# Altium schematic sheet senzMate_ecandMoisture_design_cycle2.SchDoc
size A
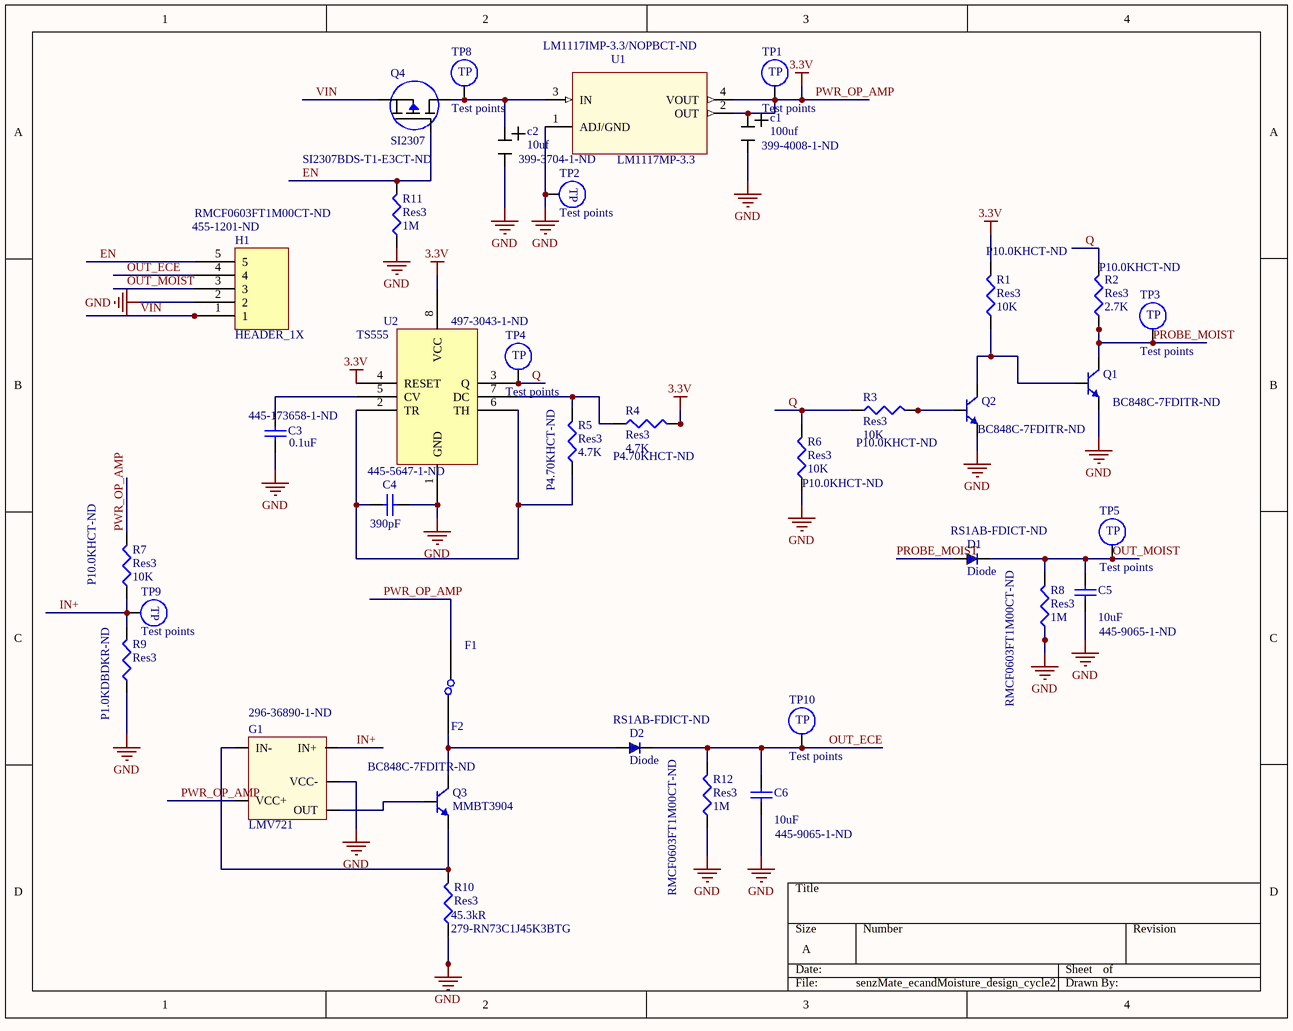
[diagram p0: senzMate_ecandMoisture_design_cycle2.SchDoc]

## Parts
c1  100uf  Supplier Part Number 1: 399-4008-1-ND  [tan_cap]
c2  10uf  Supplier Part Number 1: 399-3704-1-ND  [tan_cap]
C3  value 0.1uF  Supplier Part Number 1: 445-173658-1-ND  [CAPACITOR_0603]  (hidden comment: SMT Ceremic capacitors)
C4  value 390pF  Supplier Part Number 1: 445-5647-1-ND  [CAPACITOR_0603]  (hidden comment: SMT Ceremic capacitors)
C5  value 10uF  Supplier Part Number 1: 445-9065-1-ND  [CAPACITOR_0603]  (hidden comment: SMT Ceremic capacitors)
C6  value 10uF  Supplier Part Number 1: 445-9065-1-ND  [CAPACITOR_0603]  (hidden comment: SMT Ceremic capacitors)
D1  Diode  Supplier Part Number 1: RS1AB-FDICT-ND  [Diode]
D2  Diode  Supplier Part Number 1: RS1AB-FDICT-ND  [Diode]
F1  Hole  [HOLE]  (value not drawn)
F2  Hole  [HOLE]  (value not drawn)
G1  LMV721  Supplier Part Number 1: 296-36890-1-ND  [lm721]
H1  HEADER_1X  Supplier Part Number 1: 455-1201-ND  [CONNECTOR]
Q1  Supplier Part Number 1: BC848C-7FDITR-ND  [SOT95P245X110-3N]
Q2  Supplier Part Number 1: BC848C-7FDITR-ND  [SOT95P245X110-3N]
Q3  MMBT3904  Supplier Part Number 1: BC848C-7FDITR-ND  [SOT95P245X110-3N]
Q4  SI2307  Supplier Part Number 1: SI2307BDS-T1-E3CT-ND  [SI2307]
R1  Res3  value 10K  Supplier Part Number 1: P10.0KHCT-ND  [RES_0603]
R2  Res3  value 2.7K  Supplier Part Number 1: P10.0KHCT-ND  [RES_0603]
R3  Res3  value 10K  Supplier Part Number 1: P10.0KHCT-ND  [RES_0603]
R4  Res3  value 4.7K  Supplier Part Number 1: P4.70KHCT-ND  [RES_0603]
R5  Res3  value 4.7K  Supplier Part Number 1: P4.70KHCT-ND  [RES_0603]
R6  Res3  value 10K  Supplier Part Number 1: P10.0KHCT-ND  [RES_0603]
R7  Res3  value 10K  Supplier Part Number 1: P10.0KHCT-ND  [RES_0603]
R8  Res3  value 1M  Supplier Part Number 1: RMCF0603FT1M00CT-ND  [RES_0603]
R9  Res3  Supplier Part Number 1: P1.0KDBDKR-ND  [RES_0603]
R10  Res3  Supplier Part Number 1: 279-RN73C1J45K3BTG  Resistance: 45.3kR  [RES_0603]
R11  Res3  value 1M  Supplier Part Number 1: RMCF0603FT1M00CT-ND  [RES_0603]
R12  Res3  value 1M  Supplier Part Number 1: RMCF0603FT1M00CT-ND  [RES_0603]
TP1  Test points  [Test_point]
TP2  Test points  [Test_point]
TP3  Test points  [Test_point]
TP4  Test points  [Test_point]
TP5  Test points  [Test_point]
TP8  Test points  [Test_point]
TP9  Test points  [Test_point]
TP10  Test points  [Test_point]
U1  LM1117MP-3.3  Supplier Part Number 1: LM1117IMP-3.3/NOPBCT-ND  [*SOT230P696X180-4N]
U2  TS555  Supplier Part Number 1: 497-3043-1-ND  [SOP127P600X175-8N]

## Nets
GND: c1.2 c2.2 C3.1 C4.1 C5.1 C6.1 G1.2(VCC-) H1.2 Q1.1(E) Q2.1(E) R6.1 R8.1 R9.1 R10.1 R11.1 R12.1 TP2.1 U1.1(ADJ/GND) U2.1(GND)
PWR_OP_AMP: c1.1 F1.1 G1.5(VCC+) R1.2 R4.2 R7.2 TP1.1 U1.2(OUT) U1.4(VOUT) U2.4(RESET) U2.8(VCC)  [also labelled 3.3V]
EN: H1.5 Q4.1(Gate) R11.2
IN+: G1.3(IN+) R7.1 R9.2 TP9.1
OUT_ECE: C6.2 D2.2(K) H1.4 R12.2 TP10.1
OUT_MOIST: C5.2 D1.2(K) H1.3 R8.2 TP5.1
PROBE_MOIST: D1.1(A) Q1.3(C) R2.1 TP3.1
Q: R2.2 R3.1 R6.2 TP4.1 U2.3(Q)
VIN: H1.1 Q4.2(Source)
Netc2_1: c2.1 Q4.3(Drain) TP8.1 U1.3(IN)
NetC3_2: C3.2 U2.5(CV)
NetC4_2: C4.2 R5.1 U2.2(TR) U2.6(TH)
NetD2_1: D2.1(A) F2.1 Q3.3(C)
NetG1_1: G1.1(OUT) Q3.2(B)
NetG1_4: G1.4(IN-) Q3.1(E) R10.2
NetQ1_2: Q1.2(B) Q2.3(C) R1.1
NetQ2_2: Q2.2(B) R3.2
NetR4_1: R4.1 R5.2 U2.7(DC)

## Library data of the parts
c1 = tant_cap: Tantalum Surface Mount Capacitors – Standard Tantalum; Manufacturer: KEMET; Manufacturer Part Number: T520B107M006ATE040; Voltage Rating: 6.3V; Tolerance: 20%; ESR (Equivalent Series Resistance): 40mR; Voltage Rating (DC): 6V; Polarity: Polar; Dissipation Factor: 8%; Leakage Current: 63uA; Ripple Current: 3A; Life (Hours): 2000Hour; Supplier 1: Digi-Key; Stock 1: 86697; Pricing 1: 1=0.88, 10=0.665, 100=0.4759, 500=0.3685, 1000=0.3173 (USD); Mount: Surface Mount,PCB; Case/Package: 1411; Number of Pins: 2; Case Code (Imperial): 1411; Case Code (Metric): 3528; Dielectric Material: Tantalum; Min Operating Temperature: -55°C; Max Operating Temperature: 105°C; Capacitance: 100uF; Packaging: Tape and Reel; Package Quantity: 1; Termination: SMD/SMT; Features: General Purpose; Voltage: 6.3V; Length: 3.5mm; Height: 1.9mm; Width: 2.8mm; Height - Seated (Max): 0.083inch; Depth: 2.8mm; Lead Pitch: 1.9mm; Radiation Hardening: No; Lead Free: Lead Free; REACH SVHC: No SVHC; ComponentLink1URL: http://www.mouser.com/ds/2/212/KEM_T2015_T520-368569.pdf?src-supplier=Mouser; ComponentLink1Description: http://www.mouser.com/ds/2/212/KEM_T2015_T520-368569.pdf?src-supplier=Mouser; ComponentLink2URL: https://www.verical.com/server-webapp/html/getDatasheet?partID=72546&src-supplier=Verical; ComponentLink2Description: https://www.verical.com/server-webapp/html/getDatasheet?partID=72546&src-supplier=Verical; ComponentLink3URL: https://www.distrelec.biz/Web/Downloads/_t/ds/KEM_T2015_T520_eng_tds.pdf?mime=application%2Fpdf&src-supplier=Distrelec; ComponentLink3Description: https://www.distrelec.biz/Web/Downloads/_t/ds/KEM_T2015_T520_eng_tds.pdf?mime=application%2Fpdf&src-supplier=Distrelec; ComponentLink4URL: https://www.alliedelec.com/m/d/1e5f3e263f50a84b9c01f3b24923ff5b.pdf?src-supplier=Allied+Electronics; ComponentLink4Description: https://www.alliedelec.com/m/d/1e5f3e263f50a84b9c01f3b24923ff5b.pdf?src-supplier=Allied+Electronics; ComponentLink5URL: http://www.farnell.com/datasheets/40865.pdf?src-supplier=Farnell; ComponentLink5Description: http://www.farnell.com/datasheets/40865.pdf?src-supplier=Farnell; ComponentLink6URL: https://content.kemet.com/datasheets/KEM_T2076_T52X-530.pdf?src-supplier=Digi-Key; ComponentLink6Description: https://content.kemet.com/datasheets/KEM_T2076_T52X-530.pdf?src-supplier=Digi-Key; ComponentLink7URL: http://www.kemet.com/kemet/web/homepage/kechome.nsf/file/T520%20Series/$file/KEM_T2015_T520.pdf?src-supplier=Element14; ComponentLink7Description: http://www.kemet.com/kemet/web/homepage/kechome.nsf/file/T520%20Series/$file/KEM_T2015_T520.pdf?src-supplier=Element14; Value: 100uF
c2 = tant_cap: Tantalum Surface Mount Capacitors – Standard Tantalum; Manufacturer: KEMET; Manufacturer Part Number: T491B106K006AT; Voltage Rating (DC): 6.3V; ESR (Equivalent Series Resistance): 3.5R; Tolerance: 10%; Polarity: Polar; Dissipation Factor: 6%; Leakage Current: 600nA; Ripple Current: 156mA; Life (Hours): 2000Hour; Supplier 1: Digi-Key; Stock 1: 12761; Pricing 1: 1=0.49, 10=0.345, 100=0.227, 500=0.1681, 1000=0.1429 (USD); Mount: Surface Mount,PCB; Case/Package: 1411; Number of Pins: 2; Weight: 0.002293oz; Case Code (Imperial): 1411; Case Code (Metric): 3528; Dielectric Material: Tantalum; Min Operating Temperature: -55°C; Max Operating Temperature: 125°C; Package Quantity: 1; Capacitance: 10uF; Voltage Rating: 6.3V; Packaging: Tape and Reel; Termination: SMD/SMT; Features: General Purpose; Voltage: 6.3V; Length: 3.5mm; Height: 1.9mm; Width: 2.8mm; Height - Seated (Max): 0.083inch; Depth: 2.8mm; Radiation Hardening: No; REACH SVHC: No SVHC; Lead Free: Lead Free; ComponentLink1URL: http://www.mouser.com/ds/2/212/KEM_T2005_T491-1093550.pdf?src-supplier=Mouser; ComponentLink1Description: http://www.mouser.com/ds/2/212/KEM_T2005_T491-1093550.pdf?src-supplier=Mouser; ComponentLink2URL: https://www.verical.com/server-webapp/html/getDatasheet?partID=114876&src-supplier=Verical; ComponentLink2Description: https://www.verical.com/server-webapp/html/getDatasheet?partID=114876&src-supplier=Verical; ComponentLink3URL: https://search.kemet.com/component-edge/download/datasheet/T491B106K006AT.pdf?src-supplier=Digi-Key; ComponentLink3Description: https://search.kemet.com/component-edge/download/datasheet/T491B106K006AT.pdf?src-supplier=Digi-Key; ComponentLink4URL: https://www.alliedelec.com/m/d/1172a60f7bb3eb66344f86e8fb9ddbde.pdf?src-supplier=Allied+Electronics; ComponentLink4Description: https://www.alliedelec.com/m/d/1172a60f7bb3eb66344f86e8fb9ddbde.pdf?src-supplier=Allied+Electronics; ComponentLink5URL: http://www.kemet.com/kemet/web/homepage/kechome.nsf/file/T491%20Series/$file/KEM_T2005_T491.pdf?src-supplier=Farnell; ComponentLink5Description: http://www.kemet.com/kemet/web/homepage/kechome.nsf/file/T491%20Series/$file/KEM_T2005_T491.pdf?src-supplier=Farnell; ComponentLink6URL: http://www.farnell.com/datasheets/1854511.pdf?src-supplier=Element14; ComponentLink6Description: http://www.farnell.com/datasheets/1854511.pdf?src-supplier=Element14; ComponentLink7URL: http://www.kemet.com/kemet/web/homepage/kechome.nsf/file/T491%20Series/$file/KEM_T2005_T491.pdf?src-supplier=Element14; ComponentLink7Description: http://www.kemet.com/kemet/web/homepage/kechome.nsf/file/T491%20Series/$file/KEM_T2005_T491.pdf?src-supplier=Element14; ComponentLink8URL: http://www.jameco.com/Jameco/Products/ProdDS/1640982.pdf?src-supplier=Jameco; ComponentLink8Description: http://www.jameco.com/Jameco/Products/ProdDS/1640982.pdf?src-supplier=Jameco; ComponentLink9URL: https://www.distrelec.biz/Web/Downloads/_t/ds/KEM_T2005_T491_eng_tds.pdf?mime=application%2Fpdf&src-supplier=Distrelec; ComponentLink9Description: https://www.distrelec.biz/Web/Downloads/_t/ds/KEM_T2005_T491_eng_tds.pdf?mime=application%2Fpdf&src-supplier=Distrelec; ComponentLink10URL: http://www.rapidonline.com/pdf/458281_da_en_01.pdf?src-supplier=Rapid+Electronics; ComponentLink10Description: http://www.rapidonline.com/pdf/458281_da_en_01.pdf?src-supplier=Rapid+Electronics; ComponentLink11URL: http://uk.rs-online.com/webdocs/1529/0900766b815290d2.pdf?src-supplier=RSComponents; ComponentLink11Description: http://uk.rs-online.com/webdocs/1529/0900766b815290d2.pdf?src-supplier=RSComponents; Value: 10uF
C3 = Cap: Capacitor; Manufacturer: TDK; Manufacturer Part Number: CGA3E2X8R1E104K080AE; Capacitance: 0.10µF; Tolerance: ±10%; Voltage - Rated: 25V; Temperature Coefficient: X8R; Published: 8-Jun-2000; LatestRevisionDate: 17-Jul-2002; LatestRevisionNote: Re-released for DXP Platform.; PackageReference: RAD-0.3; Publisher: Altium Limited; PackageDescription: Radial Cap, Thru-Hole; 2 Leads; 0.3 in Pin Spacing; Supplier 1: Digi-Key; Stock 1: 0; Pricing 1: 1=0.27, 10=0.182, 100=0.1032, 500=0.0729, 1000=0.0638 (USD); Category: Capacitors; Family: Ceramic Capacitors; Series: CGA; Packaging: Tape & Reel (TR); Mounting Type: Surface Mount, MLCC; Operating Temperature: -55°C ~ 150°C; Applications: Automotive, Boardflex Sensitive; Ratings: AEC-Q200; Package / Case: 0603 (1608 Metric); Size / Dimension: 0.063" L x 0.031" W (1.60mm x 0.80mm); Height - Seated (Max): -; Thickness (Max): 0.037" (0.95mm); Lead Spacing: -; Features: Soft Termination; Lead Style: -
C4 = Cap: Capacitor; Manufacturer: TDK; Manufacturer Part Number: CGA3E2C0G1H391J080AA; PCN Part Number: MLCC Part Number Change 30/Nov/2012; Product Training Modules: CGA Series for Automotive Applications SEAT, CCV, and TVCL Design Tools Guide to Replacing an Electrolytic Capacitor with an MLCC; Featured Product: CGA Series MLCC Capacitors; EDA / CAD Models: Download from Accelerated Designs; Tolerance: ±5%; Voltage - Rated: 50V; Temperature Coefficient: C0G, NP0; Online Catalog: CGA Series, Automotive General, Mid and High Voltage; Other Names: 445-5647-6; Published: 8-Jun-2000; LatestRevisionDate: 17-Jul-2002; LatestRevisionNote: Re-released for DXP Platform.; PackageReference: RAD-0.3; Publisher: Altium Limited; PackageDescription: Radial Cap, Thru-Hole; 2 Leads; 0.3 in Pin Spacing; Supplier 1: Digi-Key; Stock 1: 2144; Pricing 1: 1=0.22, 10=0.153, 100=0.072, 500=0.0505, 1000=0.0418 (USD); RoHS Information: CGA Series, RoHS Cert of Compliance; Standard Package: 1; Category: Capacitors; Family: Ceramic Capacitors; Series: CGA; Packaging: Digi-Reel®; Capacitance: 390pF; Mounting Type: Surface Mount, MLCC; Operating Temperature: -55°C ~ 125°C; Applications: Automotive; Ratings: AEC-Q200; Package / Case: 0603 (1608 Metric); Size / Dimension: 0.063" L x 0.031" W (1.60mm x 0.80mm); Thickness (Max): 0.035" (0.90mm); ComponentLink1URL: http://www.mouser.com/ds/2/400/lcc_automotive_general_en-843974.pdf?src-supplier=Mouser; ComponentLink1Description: http://www.mouser.com/ds/2/400/lcc_automotive_general_en-843974.pdf?src-supplier=Mouser
C5 C6 = Cap: Capacitor; Manufacturer: TDK; Manufacturer Part Number: C1608X5R1C106M080AB; PCN Part Number: MLCC Part Number Change 30/Nov/2012; Product Training Modules: SEAT, CCV, and TVCL Design Tools Guide to Replacing an Electrolytic Capacitor with an MLCC; Design Resources: 20 W Non-Isolated Buck LED Driver Using PL LNK460KG; EDA / CAD Models: Download from Accelerated Designs; Capacitance: 10µF; Tolerance: ±20%; Voltage - Rated: 16V; Temperature Coefficient: X5R; Online Catalog: C Series, General Purpose; Other Names: 445-9065-6; Published: 8-Jun-2000; LatestRevisionDate: 17-Jul-2002; LatestRevisionNote: Re-released for DXP Platform.; PackageReference: RAD-0.3; Publisher: Altium Limited; PackageDescription: Radial Cap, Thru-Hole; 2 Leads; 0.3 in Pin Spacing; Supplier 1: Digi-Key; Stock 1: 95952; Pricing 1: 1=0.85, 10=0.629, 100=0.4313, 500=0.3414, 1000=0.2875 (USD); RoHS Information: RoHS Certificate-MLCC; Standard Package: 1; Category: Capacitors; Family: Ceramic Capacitors; Series: C; Packaging: Digi-Reel®; Mounting Type: Surface Mount, MLCC; Operating Temperature: -55°C ~ 85°C; Applications: General Purpose; Package / Case: 0603 (1608 Metric); Size / Dimension: 0.063" L x 0.031" W (1.60mm x 0.80mm); Thickness (Max): 0.039" (1.00mm); ComponentLink1URL: https://www.verical.com/server-webapp/html/getDatasheet?partID=727879&src-supplier=Verical; ComponentLink1Description: https://www.verical.com/server-webapp/html/getDatasheet?partID=727879&src-supplier=Verical; ComponentLink2URL: http://www.mouser.com/ds/2/400/lcc_commercial_general_en-837201.pdf?src-supplier=Mouser; ComponentLink2Description: http://www.mouser.com/ds/2/400/lcc_commercial_general_en-837201.pdf?src-supplier=Mouser; ComponentLink3URL: http://product.tdk.com/capacitor/mlcc/en/documents/mlcc_commercial_general_en.pdf?src-supplier=Future+Electronics; ComponentLink3Description: http://product.tdk.com/capacitor/mlcc/en/documents/mlcc_commercial_general_en.pdf?src-supplier=Future+Electronics
D1 D2 = Diode: Manufacturer: Diodes; Manufacturer Part Number: RS1AB-13-F; Forward Current: 1A; Peak Reverse Current: 5uA; Reverse Recovery Time: 150ns; Peak Non-Repetitive Surge Current: 30A; Element Configuration: Single; Forward Voltage: 1.3V; Reverse Voltage (DC): 50V; Polarity: Standard; Capacitance: 15pF; Supplier 1: Digi-Key; Stock 1: 31687; Pricing 1: 1=0.4, 10=0.302, 100=0.1879, 500=0.1285, 1000=0.0989 (USD); Mount: Surface Mount; Case/Package: SMB; Number of Pins: 2; Weight: 0.00328oz; Min Operating Temperature: -65°C; Max Operating Temperature: 150°C; Packaging: Tape and Reel; Package Quantity: 3000; Max Surge Current: 30A; Recovery Time: 150ns; Average Rectified Current: 1A; Voltage Rating (DC): 50V; Current Rating: 1A; Output Current: 1A; Max Reverse Voltage (DC): 50V; Max Repetitive Reverse Voltage (Vrrm): 50V; Length: 4.57mm; Height: 2.42mm; Width: 3.94mm; Radiation Hardening: No; Lead Free: Lead Free; ComponentLink1URL: http://www.diodes.com///datasheets/ds15002.pdf?src-supplier=Avnet; ComponentLink1Description: http://www.diodes.com///datasheets/ds15002.pdf?src-supplier=Avnet
G1 = lm721: 2.7V to 5V Comparator with Rail-to-Rail Output; Manufacturer: Texas Instruments; Manufacturer Part Number: LMV721IDCKR; Common Mode Rejection Ratio: 80dB; Number of Channels: 1; Output Current: 17.6mA; Min Supply Voltage: 2.2V; Input Offset Voltage (Vos): 3mV; Power Supply Rejection Ratio (PSRR): 70dB; Nominal Supply Current: 1.4mA; Input Bias Current: 260nA; Slew Rate: 5.25V/µs; Unity Gain Bandwidth Product: 10MHz; Voltage Gain: 94dB; Operating Supply Current: 1.03mA; Output Current per Channel: 52.6mA; Supplier 1: Digi-Key; Stock 1: 11033; Pricing 1: 1=1.02, 10=0.912, 100=0.7107, 500=0.5871, 1000=0.4635 (USD); Mount: Surface Mount; Case/Package: SC; Number of Pins: 5; Min Operating Temperature: -40°C; Max Operating Temperature: 105°C; Packaging: Tape and Reel; Max Supply Voltage: 5V; Number of Elements: 1; Package Quantity: 3000; Number of Circuits: 1; Gain Bandwidth Product: 10MHz; Bandwidth: 10MHz; Radiation Hardening: No; Lead Free: Lead Free; ComponentLink1URL: http://www.ti.com/lit/ds/symlink/lmv721.pdf?src-supplier=Digi-Key; ComponentLink1Description: http://www.ti.com/lit/ds/symlink/lmv721.pdf?src-supplier=Digi-Key; ComponentLink2URL: http://www.ti.com/general/docs/lit/getliterature.tsp?genericPartNumber=LMV722&&fileType=pdf&src-supplier=Avnet; ComponentLink2Description: http://www.ti.com/general/docs/lit/getliterature.tsp?genericPartNumber=LMV722&&fileType=pdf&src-supplier=Avnet
H1 = HEADER1X5: Manufacturer: JST; Manufacturer Part Number: ZHR-5; Connector Type: Receptacle,Socket; Number of Positions: 5; Gender: Receptacle; Current Rating: 1A; Max Voltage Rating (AC): 50V; Contact Resistance: 20mR; Insulation Resistance: 500MR; Test Voltage: 500V; Pitch: 1.5mm; Supplier 1: Digi-Key; Stock 1: 14765; Pricing 1: 1=0.1, 10=0.089, 25=0.0664, 50=0.057, 100=0.055, 250=0.0474, 500=0.0456, 1000=0.0399, 2500=0.0361 (USD); Mount: Free Hanging,Cable; Weight: 0.0625lb; Color: Natural; Contact Material: Bronze,Tin; Housing Color: White; Housing Material: Polyamide; Min Operating Temperature: -25°C; Max Operating Temperature: 85°C; Number of Rows: 1; Packaging: Bag; Termination: Crimp; Number of Contacts: 5; Orientation: Straight; Max Current Rating: 1A; Max Voltage Rating (DC): 50V; Length: 9mm; Height: 0.16inch; Depth: 4.8mm; Width: 3.4mm; REACH SVHC: No SVHC; Lead Free: Lead Free; ComponentLink1URL: https://www.verical.com/server-webapp/html/getDatasheet?partID=454593&src-supplier=Verical; ComponentLink1Description: https://www.verical.com/server-webapp/html/getDatasheet?partID=454593&src-supplier=Verical; ComponentLink2URL: http://www.farnell.com/datasheets/1393424.pdf?src-supplier=Element14; ComponentLink2Description: http://www.farnell.com/datasheets/1393424.pdf?src-supplier=Element14; ComponentLink3URL: https://www.distrelec.biz/Web/Downloads/_t/ds/zh-series_eng_tds.pdf?mime=application%2Fpdf&src-supplier=Distrelec; ComponentLink3Description: https://www.distrelec.biz/Web/Downloads/_t/ds/zh-series_eng_tds.pdf?mime=application%2Fpdf&src-supplier=Distrelec; ComponentLink4URL: http://www1.futureelectronics.com/doc/JST/ZHR-5.pdf?src-supplier=Future+Electronics; ComponentLink4Description: http://www1.futureelectronics.com/doc/JST/ZHR-5.pdf?src-supplier=Future+Electronics
Q1-Q3 = npn: Transistor npn; Manufacturer: Diodes; Manufacturer Part Number: BC848C-7-F; Configuration: Single; Collector- Emitter Voltage VCEO Max: 30 V; Emitter- Base Voltage VEBO: 5 V; Collector-Emitter Saturation Voltage: 200 V; Maximum DC Collector Current: 0.1 A; Gain Bandwidth Product fT: 300 MHz; Brand: Diodes Incorporated; DC Collector/Base Gain hfe Min: 420; DC Current Gain hFE Max: 800 at 2 mA at 5 V; Pd - Power Dissipation: 350 mW; Unit Weight: 0.000282 oz; Supplier 1: Digi-Key; Stock 1: 120000; Pricing 1: 3000=0.0365, 6000=0.0329, 15000=0.0286, 30000=0.0257, 75000=0.0229, 150000=0.019 (USD); Product Category: Bipolar Transistors - BJT; RoHS: True; Mounting Style: SMD/SMT; Package / Case: SOT-23-3; Transistor Polarity: NPN; Collector- Base Voltage VCBO: 30 V; Maximum Operating Temperature: + 150 C; Series: BC848C; Continuous Collector Current: 0.1 A; Height: 1 mm; Length: 3.05 mm; Minimum Operating Temperature: - 65 C; Packaging: Reel; Factory Pack Quantity: 3000; Width: 1.4 mm; ComponentLink1URL: http://www.diodes.com///datasheets/ds11108.pdf?src-supplier=Avnet+Europe; ComponentLink1Description: http://www.diodes.com///datasheets/ds11108.pdf?src-supplier=Avnet+Europe
Q4 = SI2307: P-Channel 30-V (D-S) MOSFET; Manufacturer: Vishay Siliconix; Manufacturer Part Number: SI2307BDS-T1-E3; Max Power Dissipation: 750mW; Drain to Source Voltage (Vdss): 30V; Continuous Drain Current (ID): 2.5A; Rise Time: 12ns; Drain to Source Resistance: 78mR; Gate to Source Voltage (Vgs): 20V; Turn-Off Delay Time: 25ns; Turn-On Delay Time: 9ns; Element Configuration: Single; Number of Channels: 1; Input Capacitance: 380pF; Drain to Source Breakdown Voltage: -30V; Nominal Vgs: -3V; Supplier 1: Digi-Key; Stock 1: 33368; Pricing 1: 1=0.52, 10=0.446, 100=0.3331, 500=0.2617, 1000=0.2022 (USD); Mount: Surface Mount; Case/Package: TO-236; Number of Pins: 3; Weight: 0.050717oz; Min Operating Temperature: -55°C; Max Operating Temperature: 150°C; Package Quantity: 1; Packaging: Tape and Reel; Fall Time: 12ns; Rds On Max: 78mR; Power Dissipation: 750mW; Number of Elements: 1; Threshold Voltage: -3V; On-State Resistance: 78mR; Length: 3.04mm; Height: 1.02mm; Width: 1.4mm; Radiation Hardening: No; REACH SVHC: Unknown; Lead Free: Lead Free; ComponentLink1URL: http://www.vishay.com/docs/72699/72699.pdf?src-supplier=Digi-Key; ComponentLink1Description: http://www.vishay.com/docs/72699/72699.pdf?src-supplier=Digi-Key; ComponentLink2URL: http://www.vishay.com/docs/72699/72699.pdf?src-supplier=Avnet+Europe; ComponentLink2Description: http://www.vishay.com/docs/72699/72699.pdf?src-supplier=Avnet+Europe; ComponentLink3URL: http://www.vishay.com/docs/72699/72699.pdf?src-supplier=Farnell; ComponentLink3Description: http://www.vishay.com/docs/72699/72699.pdf?src-supplier=Farnell; ComponentLink4URL: https://www.verical.com/server-webapp/html/getDatasheet?partID=74726&src-supplier=Verical; ComponentLink4Description: https://www.verical.com/server-webapp/html/getDatasheet?partID=74726&src-supplier=Verical; ComponentLink5URL: http://www.farnell.com/datasheets/2049185.pdf?src-supplier=Element14; ComponentLink5Description: http://www.farnell.com/datasheets/2049185.pdf?src-supplier=Element14; ComponentLink6URL: http://datasheet.iiic.cc/vishay_[siliconix]/SI2307BDS-T1-E3.pdf?src-supplier=IIIC; ComponentLink6Description: http://datasheet.iiic.cc/vishay_[siliconix]/SI2307BDS-T1-E3.pdf?src-supplier=IIIC
R1-R3 R6 R7 = Res3: Resistor; Manufacturer: Panasonic; Manufacturer Part Number: ERJ-3EKF1002V; Resistance: 10kR; Power Rating: 100mW; Tolerance: 1%; Voltage Rating: 75V; Temperature Coefficient: 100ppm/°C; Published: 8-Jun-2000; LatestRevisionDate: 29-May-2009; LatestRevisionNote: IPC-7351 Footprint Added.; PackageReference: J1-0603; Publisher: Altium Limited; PackageDescription: Chip Resistor; Supplier 1: Digi-Key; Stock 1: 10990122; Pricing 1: 1=0.1, 10=0.065, 100=0.0264, 1000=0.0119, 2500=0.0103 (USD); Mount: Surface Mount; Case/Package: 0603; Number of Pins: 2; Case Code (Metric): 1608; Case Code (Imperial): 0603; Contact Plating: Tin; Min Operating Temperature: -55°C; Max Operating Temperature: 155°C; Packaging: Tape and Reel; Package Quantity: 1; Termination: SMD/SMT; Max Power Dissipation: 100mW; Composition: Thick Film; Military Standard: Not; Number of Terminations: 2; Voltage Rating (DC): 75V; Features: Automotive AEC-Q200; Length: 1.6mm; Height: 0.45mm; Width: 0.031inch; Depth: 0.8mm; Radiation Hardening: No; Lead Free: Lead Free; REACH SVHC: No SVHC; ComponentLink1URL: https://industrial.panasonic.com/cdbs/www-data/pdf/RDA0000/DMA0000COL11.pdf?src-supplier=Avnet+Asia; ComponentLink1Description: https://industrial.panasonic.com/cdbs/www-data/pdf/RDA0000/DMA0000COL11.pdf?src-supplier=Avnet+Asia; ComponentLink2URL: http://www.farnell.com/datasheets/1911175.pdf?src-supplier=Element14; ComponentLink2Description: http://www.farnell.com/datasheets/1911175.pdf?src-supplier=Element14; ComponentLink3URL: https://industrial.panasonic.com/cdbs/www-data/pdf/RDA0000/DMA0000COL11.pdf?src-supplier=Avnet; ComponentLink3Description: https://industrial.panasonic.com/cdbs/www-data/pdf/RDA0000/DMA0000COL11.pdf?src-supplier=Avnet; ComponentLink4URL: http://industrial.panasonic.com/www-data/pdf/AOA0000/AOA0000CE2.pdf?src-supplier=Avnet+Europe; ComponentLink4Description: http://industrial.panasonic.com/www-data/pdf/AOA0000/AOA0000CE2.pdf?src-supplier=Avnet+Europe; ComponentLink5URL: http://industrial.panasonic.com/www-data/pdf/AOA0000/AOA0000CE2.pdf?src-supplier=Avnet; ComponentLink5Description: http://industrial.panasonic.com/www-data/pdf/AOA0000/AOA0000CE2.pdf?src-supplier=Avnet; ComponentLink6URL: https://industrial.panasonic.com/cdbs/www-data/pdf/RDA0000/DMA0000COL11.pdf?src-supplier=Mouser; ComponentLink6Description: https://industrial.panasonic.com/cdbs/www-data/pdf/RDA0000/DMA0000COL11.pdf?src-supplier=Mouser; ComponentLink7URL: https://industrial.panasonic.com/cdbs/www-data/pdf/RDA0000/DMA0000COL11.pdf?src-supplier=Allied+Electronics; ComponentLink7Description: https://industrial.panasonic.com/cdbs/www-data/pdf/RDA0000/DMA0000COL11.pdf?src-supplier=Allied+Electronics
R4 R5 = Res3: Resistor; Manufacturer: Panasonic; Manufacturer Part Number: ERJ-3EKF4701V; Tolerance: 1%; Resistance: 4.7kR; Power Rating: 100mW; Voltage Rating: 75V; Temperature Coefficient: 100ppm/°C; Published: 8-Jun-2000; LatestRevisionDate: 29-May-2009; LatestRevisionNote: IPC-7351 Footprint Added.; PackageReference: J1-0603; Publisher: Altium Limited; PackageDescription: Chip Resistor; Supplier 1: Digi-Key; Stock 1: 2210222; Pricing 1: 1=0.1, 10=0.065, 100=0.0264, 1000=0.0119, 2500=0.0103 (USD); Mount: Surface Mount; Case/Package: 0603; Number of Pins: 2; Weight: 7.1E-05oz; Case Code (Metric): 1608; Case Code (Imperial): 0603; Contact Plating: Tin; Min Operating Temperature: -55°C; Max Operating Temperature: 155°C; Packaging: Tape and Reel; Termination: SMD/SMT; Package Quantity: 1; Composition: Thick Film; Max Power Dissipation: 100mW; Voltage Rating (DC): 75V; Military Standard: Not; Number of Terminations: 2; Features: Automotive AEC-Q200; Length: 1.6mm; Height: 0.022inch; Depth: 0.8mm; Width: 0.031inch; Radiation Hardening: No; REACH SVHC: No SVHC; Lead Free: Lead Free; ComponentLink1URL: http://industrial.panasonic.com/www-data/pdf/AOA0000/AOA0000CE2.pdf?src-supplier=Future+Electronics; ComponentLink1Description: http://industrial.panasonic.com/www-data/pdf/AOA0000/AOA0000CE2.pdf?src-supplier=Future+Electronics; ComponentLink2URL: http://industrial.panasonic.com/www-data/pdf/AOA0000/AOA0000CE2.pdf?src-supplier=Avnet+Asia; ComponentLink2Description: http://industrial.panasonic.com/www-data/pdf/AOA0000/AOA0000CE2.pdf?src-supplier=Avnet+Asia; ComponentLink3URL: http://www.farnell.com/datasheets/1911175.pdf?src-supplier=Element14; ComponentLink3Description: http://www.farnell.com/datasheets/1911175.pdf?src-supplier=Element14; ComponentLink4URL: http://industrial.panasonic.com/www-data/pdf/AOA0000/AOA0000CE2.pdf?src-supplier=Avnet; ComponentLink4Description: http://industrial.panasonic.com/www-data/pdf/AOA0000/AOA0000CE2.pdf?src-supplier=Avnet; ComponentLink5URL: http://www.alliedelec.com/m/d/623f45ff1957d936ff56d46fd1c28cac.pdf?src-supplier=Allied+Electronics; ComponentLink5Description: http://www.alliedelec.com/m/d/623f45ff1957d936ff56d46fd1c28cac.pdf?src-supplier=Allied+Electronics; ComponentLink6URL: http://www.mouser.com/ds/2/315/AOA0000C86-911473.pdf?src-supplier=Mouser; ComponentLink6Description: http://www.mouser.com/ds/2/315/AOA0000C86-911473.pdf?src-supplier=Mouser; ComponentLink7URL: http://industrial.panasonic.com/www-data/pdf/AOA0000/AOA0000CE2.pdf?src-supplier=Avnet+Europe; ComponentLink7Description: http://industrial.panasonic.com/www-data/pdf/AOA0000/AOA0000CE2.pdf?src-supplier=Avnet+Europe; ComponentLink8URL: http://industrial.panasonic.com/www-data/pdf/AOA0000/AOA0000CE2.pdf?src-supplier=Element14; ComponentLink8Description: http://industrial.panasonic.com/www-data/pdf/AOA0000/AOA0000CE2.pdf?src-supplier=Element14
R8 R11 R12 = Res3: Resistor; Manufacturer: Stackpole Electronics; Manufacturer Part Number: RMCF0603FT1M00; Resistance: 1MR; Power Rating: 100mW; Tolerance: 1%; Temperature Coefficient: 100ppm/°C; Working Voltage: 75V; Published: 8-Jun-2000; LatestRevisionDate: 29-May-2009; LatestRevisionNote: IPC-7351 Footprint Added.; PackageReference: J1-0603; Publisher: Altium Limited; PackageDescription: Chip Resistor; Supplier 1: Digi-Key; Stock 1: 683184; Pricing 1: 1=0.1, 10=0.017, 100=0.0068, 1000=0.0031, 2500=0.0027 (USD); Mount: Surface Mount; Case/Package: 0603; Case Code (Metric): 1608; Case Code (Imperial): 0603; Contact Plating: Tin,Matte; Min Operating Temperature: -55°C; Max Operating Temperature: 155°C; Packaging: Tape and Reel; Composition: Thick Film; Number of Terminations: 2; Max Power Dissipation: 100mW; Features: Automotive AEC-Q200; Military Standard: Not; Length: 1.55mm; Height: 0.022inch; Width: 0.031inch; Depth: 0.8mm; Radiation Hardening: No; Lead Free: Lead Free; ComponentLink1URL: https://www.verical.com/server-webapp/html/getDatasheet?partID=363151&src-supplier=Verical; ComponentLink1Description: https://www.verical.com/server-webapp/html/getDatasheet?partID=363151&src-supplier=Verical
R9 = Res3: Resistor; Manufacturer: Panasonic; Manufacturer Part Number: ERA-3AEB102V; Tolerance: 0.1%; Resistance: 1kR; Power Rating: 100mW; Temperature Coefficient: 25ppm/°C; Voltage Rating: 75V; Value: 1K; Supplier 1: Digi-Key; Stock 1: 972375; Pricing 1: 1=0.35, 10=0.3, 100=0.1172, 1000=0.0491, 2500=0.045 (USD); Mount: Surface Mount; Case/Package: 0603; Number of Pins: 2; Case Code (Imperial): 0603; Case Code (Metric): 1608; Contact Plating: Tin; Min Operating Temperature: -55°C; Max Operating Temperature: 155°C; Packaging: Tape and Reel; Military Standard: Not; Termination: SMD/SMT; Package Quantity: 5000; Composition: Thin Film; Number of Terminations: 2; Max Power Dissipation: 100mW; Length: 1.6mm; Height: 0.45mm; Depth: 0.8mm; Width: 0.8mm; Radiation Hardening: No; REACH SVHC: No SVHC; ComponentLink1URL: http://uk.rs-online.com/webdocs/148c/0900766b8148c48a.pdf?src-supplier=RSComponents; ComponentLink1Description: http://uk.rs-online.com/webdocs/148c/0900766b8148c48a.pdf?src-supplier=RSComponents; ComponentLink2URL: https://industrial.panasonic.com/cdbs/www-data/pdf/RDM0000/AOA0000C307.pdf?src-supplier=Mouser; ComponentLink2Description: https://industrial.panasonic.com/cdbs/www-data/pdf/RDM0000/AOA0000C307.pdf?src-supplier=Mouser; ComponentLink3URL: https://industrial.panasonic.com/cdbs/www-data/pdf/RDM0000/AOA0000C307.pdf?src-supplier=Distrelec; ComponentLink3Description: https://industrial.panasonic.com/cdbs/www-data/pdf/RDM0000/AOA0000C307.pdf?src-supplier=Distrelec; ComponentLink4URL: http://www.alliedelec.com/m/d/b6b0537e86f421aa7f5975bb1d8f429a.pdf?src-supplier=Allied+Electronics; ComponentLink4Description: http://www.alliedelec.com/m/d/b6b0537e86f421aa7f5975bb1d8f429a.pdf?src-supplier=Allied+Electronics; ComponentLink5URL: http://www.farnell.com/datasheets/2059650.pdf?src-supplier=Element14; ComponentLink5Description: http://www.farnell.com/datasheets/2059650.pdf?src-supplier=Element14; ComponentLink6URL: http://www.farnell.com/datasheets/485442.pdf?src-supplier=Element14; ComponentLink6Description: http://www.farnell.com/datasheets/485442.pdf?src-supplier=Element14; ComponentLink7URL: http://industrial.panasonic.com/www-data/pdf/AOA0000/AOA0000CE26.pdf?src-supplier=Future+Electronics; ComponentLink7Description: http://industrial.panasonic.com/www-data/pdf/AOA0000/AOA0000CE26.pdf?src-supplier=Future+Electronics; ComponentLink8URL: http://www.farnell.com/datasheets/2052875.pdf?src-supplier=Farnell; ComponentLink8Description: http://www.farnell.com/datasheets/2052875.pdf?src-supplier=Farnell; ComponentLink9URL: https://industrial.panasonic.com/cdbs/www-data/pdf/RDM0000/AOA0000C307.pdf?src-supplier=Avnet; ComponentLink9Description: https://industrial.panasonic.com/cdbs/www-data/pdf/RDM0000/AOA0000C307.pdf?src-supplier=Avnet; ComponentLink10URL: http://www.farnell.com/datasheets/485442.pdf?src-supplier=Farnell; ComponentLink10Description: http://www.farnell.com/datasheets/485442.pdf?src-supplier=Farnell; ComponentLink11URL: http://industrial.panasonic.com/www-data/pdf/AOA0000/AOA0000CE26.pdf?src-supplier=Avnet+Europe; ComponentLink11Description: http://industrial.panasonic.com/www-data/pdf/AOA0000/AOA0000CE26.pdf?src-supplier=Avnet+Europe; ComponentLink12URL: http://www.produktinfo.conrad.com/datenblaetter/450000-474999/450752-da-01-en-WIDERSTAND_0603_ERA.pdf?src-supplier=Conrad; ComponentLink12Description: http://www.produktinfo.conrad.com/datenblaetter/450000-474999/450752-da-01-en-WIDERSTAND_0603_ERA.pdf?src-supplier=Conrad
R10 = Res3: Resistor; Manufacturer: TE Connectivity; Manufacturer Part Number: RN73C1J45K3BTG; Tolerance: 0.1%; Temperature Coefficient: 10ppm/°C; Power Rating: 63mW; Voltage Rating: 50V; Number of Resistors: 1; Value: 45.3K; Supplier 1: Mouser; Stock 1: 10; Pricing 1: 1=1.47, 10=1.25, 50=1.25, 100=1.14, 250=1.03, 500=0.948, 1000=0.813, 2500=0.759, 5000=0.721, 10000=0.704 (USD); Mount: Surface Mount; Case/Package: 0603; Number of Pins: 2; Weight: 7.1E-05oz; Case Code (Imperial): 0603; Case Code (Metric): 1608; Min Operating Temperature: -55°C; Max Operating Temperature: 155°C; Packaging: Cut Tape; Composition: Thin Film; Voltage Rating (DC): 50V; Termination: Solder; Number of Terminations: 2; Package Quantity: 250; Length: 1.55mm; Height: 0.45mm; Width: 0.8mm; Depth: 0.8mm; REACH SVHC: No SVHC; ELV: Compliant; ComponentLink1URL: https://www.alliedelec.com/m/d/c2fadee5ec306a263fe629753774eeae.pdf?src-supplier=Allied+Electronics; ComponentLink1Description: https://www.alliedelec.com/m/d/c2fadee5ec306a263fe629753774eeae.pdf?src-supplier=Allied+Electronics; ComponentLink2URL: http://www.farnell.com/datasheets/1468317.pdf?src-supplier=Element14; ComponentLink2Description: http://www.farnell.com/datasheets/1468317.pdf?src-supplier=Element14; ComponentLink3URL: http://datasheet.octopart.com/RN73C1J45K3BTG-TE-Connectivity-datasheet-11121106.pdf?src-supplier=Element14; ComponentLink3Description: http://datasheet.octopart.com/RN73C1J45K3BTG-TE-Connectivity-datasheet-11121106.pdf?src-supplier=Element14; ComponentLink4URL: http://datasheet.octopart.com/RN73C1J45K3BTG-TE-Connectivity-datasheet-67796562.pdf?src-supplier=Electro+Sonic; ComponentLink4Description: http://datasheet.octopart.com/RN73C1J45K3BTG-TE-Connectivity-datasheet-67796562.pdf?src-supplier=Electro+Sonic; ComponentLink5URL: http://datasheet.octopart.com/RN73C1J45K3BTG-TE-Connectivity-datasheet-11120284.pdf?src-supplier=Master+Electronics; ComponentLink5Description: http://datasheet.octopart.com/RN73C1J45K3BTG-TE-Connectivity-datasheet-11120284.pdf?src-supplier=Master+Electronics; ComponentLink6URL: http://sigma.octopart.com/14569836/technical_drawing/TE-Connectivity-RN73C1J45K3BTG.pdf?src-supplier=TE+Connectivity; ComponentLink6Description: http://sigma.octopart.com/14569836/technical_drawing/TE-Connectivity-RN73C1J45K3BTG.pdf?src-supplier=TE+Connectivity; ComponentLink7URL: http://datasheet.octopart.com/RN73C1J45K3BTG-TE-Connectivity-datasheet-11120060.pdf?src-supplier=TE+Connectivity; ComponentLink7Description: http://datasheet.octopart.com/RN73C1J45K3BTG-TE-Connectivity-datasheet-11120060.pdf?src-supplier=TE+Connectivity; ComponentLink8URL: http://datasheet.octopart.com/RN73C1J45K3BTG-TE-Connectivity-datasheet-62056503.pdf?src-supplier=Electro+Sonic; ComponentLink8Description: http://datasheet.octopart.com/RN73C1J45K3BTG-TE-Connectivity-datasheet-62056503.pdf?src-supplier=Electro+Sonic; ComponentLink9URL: http://datasheet.octopart.com/RN73C1J45K3BTG-Tyco-Electronics-datasheet-499933.pdf?src-supplier=Element14; ComponentLink9Description: http://datasheet.octopart.com/RN73C1J45K3BTG-Tyco-Electronics-datasheet-499933.pdf?src-supplier=Element14; ComponentLink10URL: http://datasheet.octopart.com/RN73C1J45K3BTG-TE-Connectivity-datasheet-20739865.pdf?src-supplier=Allied+Electronics; ComponentLink10Description: http://datasheet.octopart.com/RN73C1J45K3BTG-TE-Connectivity-datasheet-20739865.pdf?src-supplier=Allied+Electronics; ComponentLink11URL: http://datasheet.octopart.com/RN73C1J45K3BTG-TE-Connectivity-datasheet-62345988.pdf?src-supplier=Element14; ComponentLink11Description: http://datasheet.octopart.com/RN73C1J45K3BTG-TE-Connectivity-datasheet-62345988.pdf?src-supplier=Element14; ComponentLink12URL: http://datasheet.octopart.com/RN73C1J45K3BTG-Tyco-Electronics-datasheet-7537124.pdf?src-supplier=Farnell; ComponentLink12Description: http://datasheet.octopart.com/RN73C1J45K3BTG-Tyco-Electronics-datasheet-7537124.pdf?src-supplier=Farnell; ComponentLink13URL: http://datasheet.octopart.com/RN73C1J45K3BTG-Tyco-Electronics-datasheet-9631308.pdf?src-supplier=Allied+Electronics; ComponentLink13Description: http://datasheet.octopart.com/RN73C1J45K3BTG-Tyco-Electronics-datasheet-9631308.pdf?src-supplier=Allied+Electronics
TP1-TP5 TP8-TP10 = TP
U1 = LM1117MP-3.3: LDO Regulator Pos 3.3V 0.8A 4-Pin_3+Tab_ SOT-223 T/R; Manufacturer Part Number: LM1117IMP-3.3/NOPB; MF: Texas Instruments; Number of Outputs: 1; Output Current: 800mA; Dropout Voltage: 1.2V; Max Input Voltage: 15V; Polarity: Positive; Quiescent Current: 15mA; Accuracy: 1%; Output Type: Fixed; Min Input Voltage: 2.6V; Current Rating: 800A; Max Supply Voltage: 10V; Min Supply Voltage: 4.75V; Package: SOT-223 Texas Instruments; MP: LM1117MP-3.3; SnapEDA_Link: https://www.snapeda.com/parts/LM1117MP-3.3/Texas%20Instruments/view-part/?ref=snap; Availability: Unavailable; Price: None; Value: *; Supplier 1: Digi-Key; Manufacturer: Texas Instruments; Stock 1: 39229; Pricing 1: 1=1.14, 10=1.015, 100=0.7912, 500=0.6536 (USD); Mount: Surface Mount; Case/Package: SOT-223; Number of Pins: 4; Min Operating Temperature: -40°C; Max Operating Temperature: 125°C; Output Voltage: 3.3V; Packaging: Tape and Reel; Max Output Current: 800mA; Nominal Output Voltage: 3.3V; Output Voltage Accuracy: 1%; Package Quantity: 1000; Number of Regulators: 1; Min Current Limit: 800mA; Termination: SMD/SMT; Length: 6.5mm; Height: 1.6mm; Width: 3.56mm; Radiation Hardening: No; REACH SVHC: No SVHC; Lead Free: Lead Free; ComponentLink1URL: http://www.jameco.com/Jameco/Products/ProdDS/1281318.pdf?src-supplier=Jameco; ComponentLink1Description: http://www.jameco.com/Jameco/Products/ProdDS/1281318.pdf?src-supplier=Jameco; ComponentLink2URL: http://www.farnell.com/datasheets/1670636.pdf?src-supplier=Element14; ComponentLink2Description: http://www.farnell.com/datasheets/1670636.pdf?src-supplier=Element14; ComponentLink3URL: http://www.ti.com/lit/ds/symlink/lm1117.pdf?src-supplier=Digi-Key; ComponentLink3Description: http://www.ti.com/lit/ds/symlink/lm1117.pdf?src-supplier=Digi-Key; ComponentLink4URL: http://www.farnell.com/datasheets/1882372.pdf?src-supplier=Element14; ComponentLink4Description: http://www.farnell.com/datasheets/1882372.pdf?src-supplier=Element14; ComponentLink5URL: http://www.easyflip.co.uk/Farnell_element14_2013_UK/book.html?page=615&src-supplier=Farnell; ComponentLink5Description: http://www.easyflip.co.uk/Farnell_element14_2013_UK/book.html?page=615&src-supplier=Farnell; ComponentLink6URL: http://www.ti.com/lit/ds/symlink/lm1117-n.pdf?src-supplier=Avnet; ComponentLink6Description: http://www.ti.com/lit/ds/symlink/lm1117-n.pdf?src-supplier=Avnet; ComponentLink7URL: https://www.distrelec.biz/Web/Downloads/_t/ds/lm1117_eng_tds.pdf?mime=application%2Fpdf&src-supplier=Distrelec; ComponentLink7Description: https://www.distrelec.biz/Web/Downloads/_t/ds/lm1117_eng_tds.pdf?mime=application%2Fpdf&src-supplier=Distrelec
U2 = LM555: Timer; Manufacturer: STMicroelectronics; Manufacturer Part Number: TS555CD-T; Other Related Documents: TS555 View All Specifications; Frequency: 2.7MHz; Voltage - Supply: 2 V ~ 16 V; Current - Supply: 65µA; Dynamic Catalog: Programmable Timers and Oscillators; Other Names: 497-3043-1; Supplier 1: Digi-Key; Stock 1: 0; Standard Package: 1; Category: Integrated Circuits (ICs); Family: Clock/Timing - Programmable Timers and Oscillators; Type: 555 Type, Timer/Oscillator (Single); Operating Temperature: 0°C ~ 70°C; Package / Case: 8-SOIC (0.154", 3.90mm Width); Packaging: Cut Tape (CT); Supplier Device Package: 8-SO; Mounting Type: Surface Mount; ComponentLink1URL: http://www.farnell.com/datasheets/1690331.pdf?src-supplier=Element14; ComponentLink1Description: http://www.farnell.com/datasheets/1690331.pdf?src-supplier=Element14; ComponentLink2URL: https://www.verical.com/server-webapp/html/getDatasheet?partID=318879&src-supplier=Verical; ComponentLink2Description: https://www.verical.com/server-webapp/html/getDatasheet?partID=318879&src-supplier=Verical; ComponentLink3URL: http://www.st.com/web/en/resource/technical/document/datasheet/CD00000893.pdf?src-supplier=Avnet+Europe; ComponentLink3Description: http://www.st.com/web/en/resource/technical/document/datasheet/CD00000893.pdf?src-supplier=Avnet+Europe; ComponentLink4URL: http://www.mouser.com/ds/2/389/ts555-957352.pdf?src-supplier=Mouser; ComponentLink4Description: http://www.mouser.com/ds/2/389/ts555-957352.pdf?src-supplier=Mouser